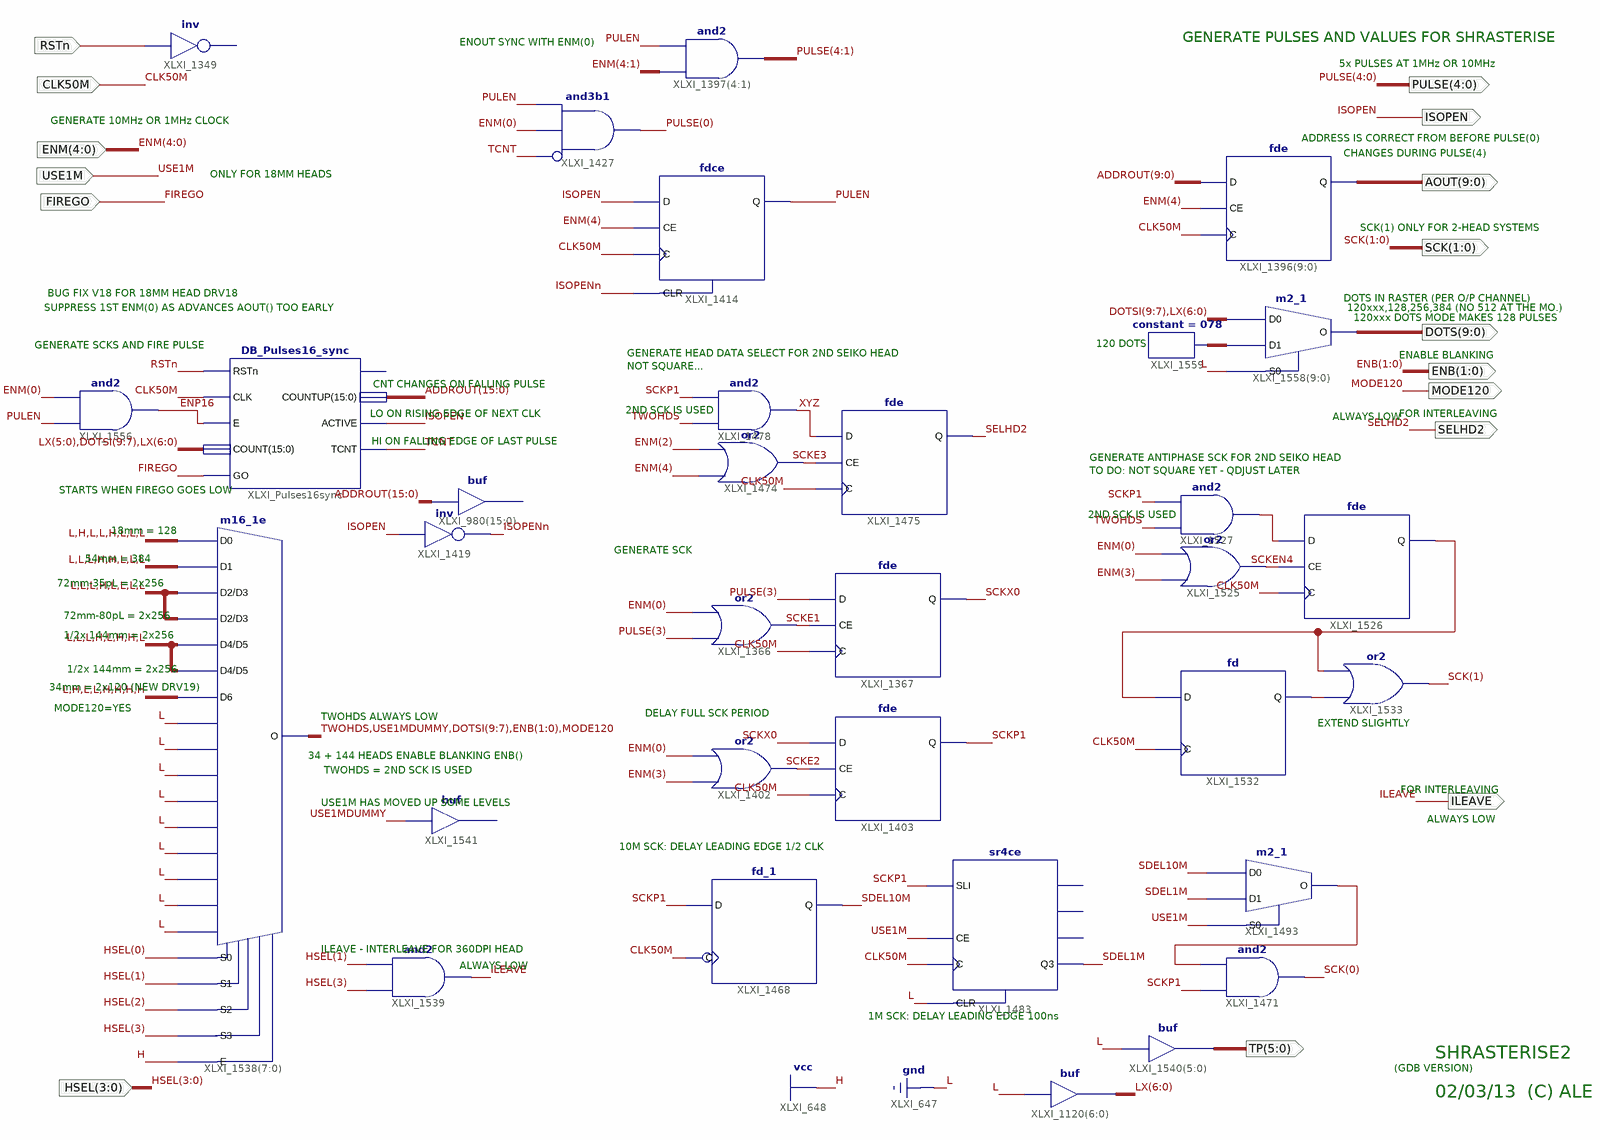
[diagram p0: schematic sheet 1]
// Xilinx ISE schematic DB_ShRasterise2.sch (spartan3e) as structural Verilog: 32 symbols, 16 ports
module DB_ShRasterise2 (
  input  RSTn,
  input  CLK50M,
  input  FIREGO,
  input  USE1M,
  input  [3:0] HSEL,
  input  [4:0] ENM,
  output ISOPEN,
  output [4:0] PULSE,
  output [9:0] DOTS,
  output SELHD2,
  output ILEAVE,
  output [5:0] TP,
  output [1:0] ENB,
  output MODE120,
  output [9:0] AOUT,
  output [1:0] SCK
);

  wire ENP16, ISOPENn, PULEN, SCKE1, SCKE2, SCKE3, SCKEN4, SCKP1, SCKX0, SDEL1M, SDEL10M, TCNT, TWOHDS,
       USE1MDUMMY, XLXN_246, XLXN_352, XLXN_364, XLXN_367, XYZ;
  wire [6:0] LX;
  wire [9:0] XLXN_375;
  wire [9:7] DOTSI;
  wire [15:0] ADDROUT;

  or XLXI_1366 (SCKE1, PULSE[3], ENM[0]);
  or XLXI_1402 (SCKE2, ENM[3], ENM[0]);
  fde XLXI_1367 (.C(CLK50M), .CE(SCKE1), .D(PULSE[3]), .Q(SCKX0));
  fde XLXI_1403 (.C(CLK50M), .CE(SCKE2), .D(SCKX0), .Q(SCKP1));
  assign LX = {7{1'b0}};  // buf XLXI_1120[6..0], 7 bits wide
  fd_1 XLXI_1468 (.C(CLK50M), .D(SCKP1), .Q(SDEL10M));
  sr4ce XLXI_1483 (.C(CLK50M), .CE(USE1M), .CLR(1'b0), .SLI(SCKP1), .Q3(SDEL1M));  // open: Q0, Q1, Q2
  m2_1 XLXI_1493 (.D0(SDEL10M), .D1(SDEL1M), .S0(USE1M), .O(XLXN_246));
  and XLXI_1471 (SCK[0], SCKP1, XLXN_246);
  // inv XLXI_1349 has open pins: I=RSTn, O=open
  or XLXI_1474 (SCKE3, ENM[4], ENM[2]);
  and XLXI_1478 (XYZ, TWOHDS, SCKP1);
  fde XLXI_1475 (.C(CLK50M), .CE(SCKE3), .D(XYZ), .Q(SELHD2));
  // buf XLXI_980[15..0] has open pins: I=ADDROUT, O=open
  not XLXI_1419 (ISOPENn, ISOPEN);
  and XLXI_1539 (ILEAVE, HSEL[3], HSEL[1]);
  m16_1e XLXI_1538[7:0] (
    .D0(8'b01001000), .D1(8'b00011000), .D10(1'b0), .D11(1'b0), .D12(1'b0), .D13(1'b0), .D14(1'b0),
    .D15(1'b0), .D2(8'b00010000), .D3(8'b00010000), .D4(8'b00010110), .D5(8'b00010110), .D6(8'b01001111),
    .D7(1'b0), .D8(1'b0), .D9(1'b0), .E(1'b1), .S0(HSEL[0]), .S1(HSEL[1]), .S2(HSEL[2]), .S3(HSEL[3]),
    .O({TWOHDS, USE1MDUMMY, DOTSI, ENB, MODE120}));
  assign TP = {6{1'b0}};  // buf XLXI_1540[5..0], 6 bits wide
  DB_Pulses16_sync XLXI_Pulses16sync (
    .ACTIVE(ISOPEN), .CLK(CLK50M), .COUNT({LX[5:0], DOTSI, LX}), .COUNTUP(ADDROUT), .E(ENP16), .GO(FIREGO),
    .RSTn(RSTn), .TCNT(TCNT));  // open: PULSEOUT
  // buf XLXI_1541 has open pins: I=USE1MDUMMY, O=open
  and XLXI_1556 (ENP16, PULEN, ENM[0]);
  assign PULSE[4:1] = ENM[4:1] & {4{PULEN}};  // and2 XLXI_1397[4..1], 4 bits wide
  and XLXI_1427 (PULSE[0], ~TCNT, ENM[0], PULEN);  // and3b1
  fdce XLXI_1414 (.C(CLK50M), .CE(ENM[4]), .CLR(ISOPENn), .D(ISOPEN), .Q(PULEN));
  or XLXI_1525 (SCKEN4, ENM[3], ENM[0]);
  and XLXI_1527 (XLXN_352, TWOHDS, SCKP1);
  fd XLXI_1532 (.C(CLK50M), .D(XLXN_367), .Q(XLXN_364));
  or XLXI_1533 (SCK[1], XLXN_364, XLXN_367);
  fde XLXI_1526 (.C(CLK50M), .CE(SCKEN4), .D(XLXN_352), .Q(XLXN_367));
  fde XLXI_1396[9:0] (.C(CLK50M), .CE(ENM[4]), .D(ADDROUT[9:0]), .Q(AOUT));
  m2_1 XLXI_1558[9:0] (.D0({DOTSI, LX}), .D1(XLXN_375), .S0(1'b0), .O(DOTS));
  constant #(.CValue("078")) XLXI_1559 (.O(XLXN_375));

  // Notes on the sheet:
  //   GENERATE PULSES AND VALUES FOR SHRASTERISE
  //   ENOUT SYNC WITH ENM(0)
  //   5x PULSES AT 1MHz OR 10MHz
  //   GENERATE 10MHz OR 1MHz CLOCK
  //   ADDRESS IS CORRECT FROM BEFORE PULSE(0)
  //   CHANGES DURING PULSE(4)
  //   ONLY FOR 18MM HEADS
  //   SCK(1) ONLY FOR 2-HEAD SYSTEMS
  //   BUG FIX V18 FOR 18MM HEAD DRV18
  //   DOTS IN RASTER (PER O/P CHANNEL)
  //   SUPPRESS 1ST ENM(0) AS ADVANCES AOUT() TOO EARLY
  //   120xxx,128,256,384 (NO 512 AT THE MO.)
  //   120xxx DOTS MODE MAKES 128 PULSES
  //   120 DOTS
  //   GENERATE SCKS AND FIRE PULSE
  //   GENERATE HEAD DATA SELECT FOR 2ND SEIKO HEAD
  //   ENABLE BLANKING
  //   NOT SQUARE...
  //   CNT CHANGES ON FALLING PULSE
  //   2ND SCK IS USED
  //   LO ON RISING EDGE OF NEXT CLK
  //   FOR INTERLEAVING
  //   ALWAYS LOW
  //   HI ON FALLING EDGE OF LAST PULSE
  //   GENERATE ANTIPHASE SCK FOR 2ND SEIKO HEAD
  //   TO DO: NOT SQUARE YET - QDJUST LATER
  //   STARTS WHEN FIREGO GOES LOW
  //   2ND SCK IS USED
  //   18mm = 128
  //   GENERATE SCK
  //   54mm = 384
  //   72mm-35pL = 2x256
  //   72mm-80pL = 2x256
  //   1/2x 144mm = 2x256
  //   1/2x 144mm = 2x256
  //   34mm = 2x120 (NEW DRV19)
  //   MODE120=YES
  //   DELAY FULL SCK PERIOD
  //   TWOHDS ALWAYS LOW
  //   EXTEND SLIGHTLY
  //   34 + 144 HEADS ENABLE BLANKING ENB()
  //   TWOHDS = 2ND SCK IS USED
  //   FOR INTERLEAVING
  //   USE1M HAS MOVED UP SOME LEVELS
  //   ALWAYS LOW
  //   10M SCK: DELAY LEADING EDGE 1/2 CLK
  //   ILEAVE - INTERLEAVE FOR 360DPI HEAD
  //   ALWAYS LOW
  //   1M SCK: DELAY LEADING EDGE 100ns
  //   SHRASTERISE2
  //   (GDB VERSION)
  //   02/03/13  (C) ALE
endmodule
